# Altium schematic sheet Comm_SQUID.SchDoc: FPGA Motherboard for Digital Multiplexed Readout, McGill U.
size B; DocumentNumber: DfMUX19; Revision: Rev0, Prototype; SheetNumber: 19; SheetTotal: 27; PageSetup: Record=PageOptions|CenterHorizontal=True|CenterVertical=True|PrintScale=0.73|XCorrection=1.00|YCorrection=1.00|PrintKind=0|BorderSize=5000000|LeftOffset=0|BottomOffset=0|Orientation=2|PaperLength=1000|PaperWidth=1000|Scale=100|PaperSource=15|PrintQuality=600|MediaType=1|DitherType=10|PaperKind=Letter|PrintScaleMode=1
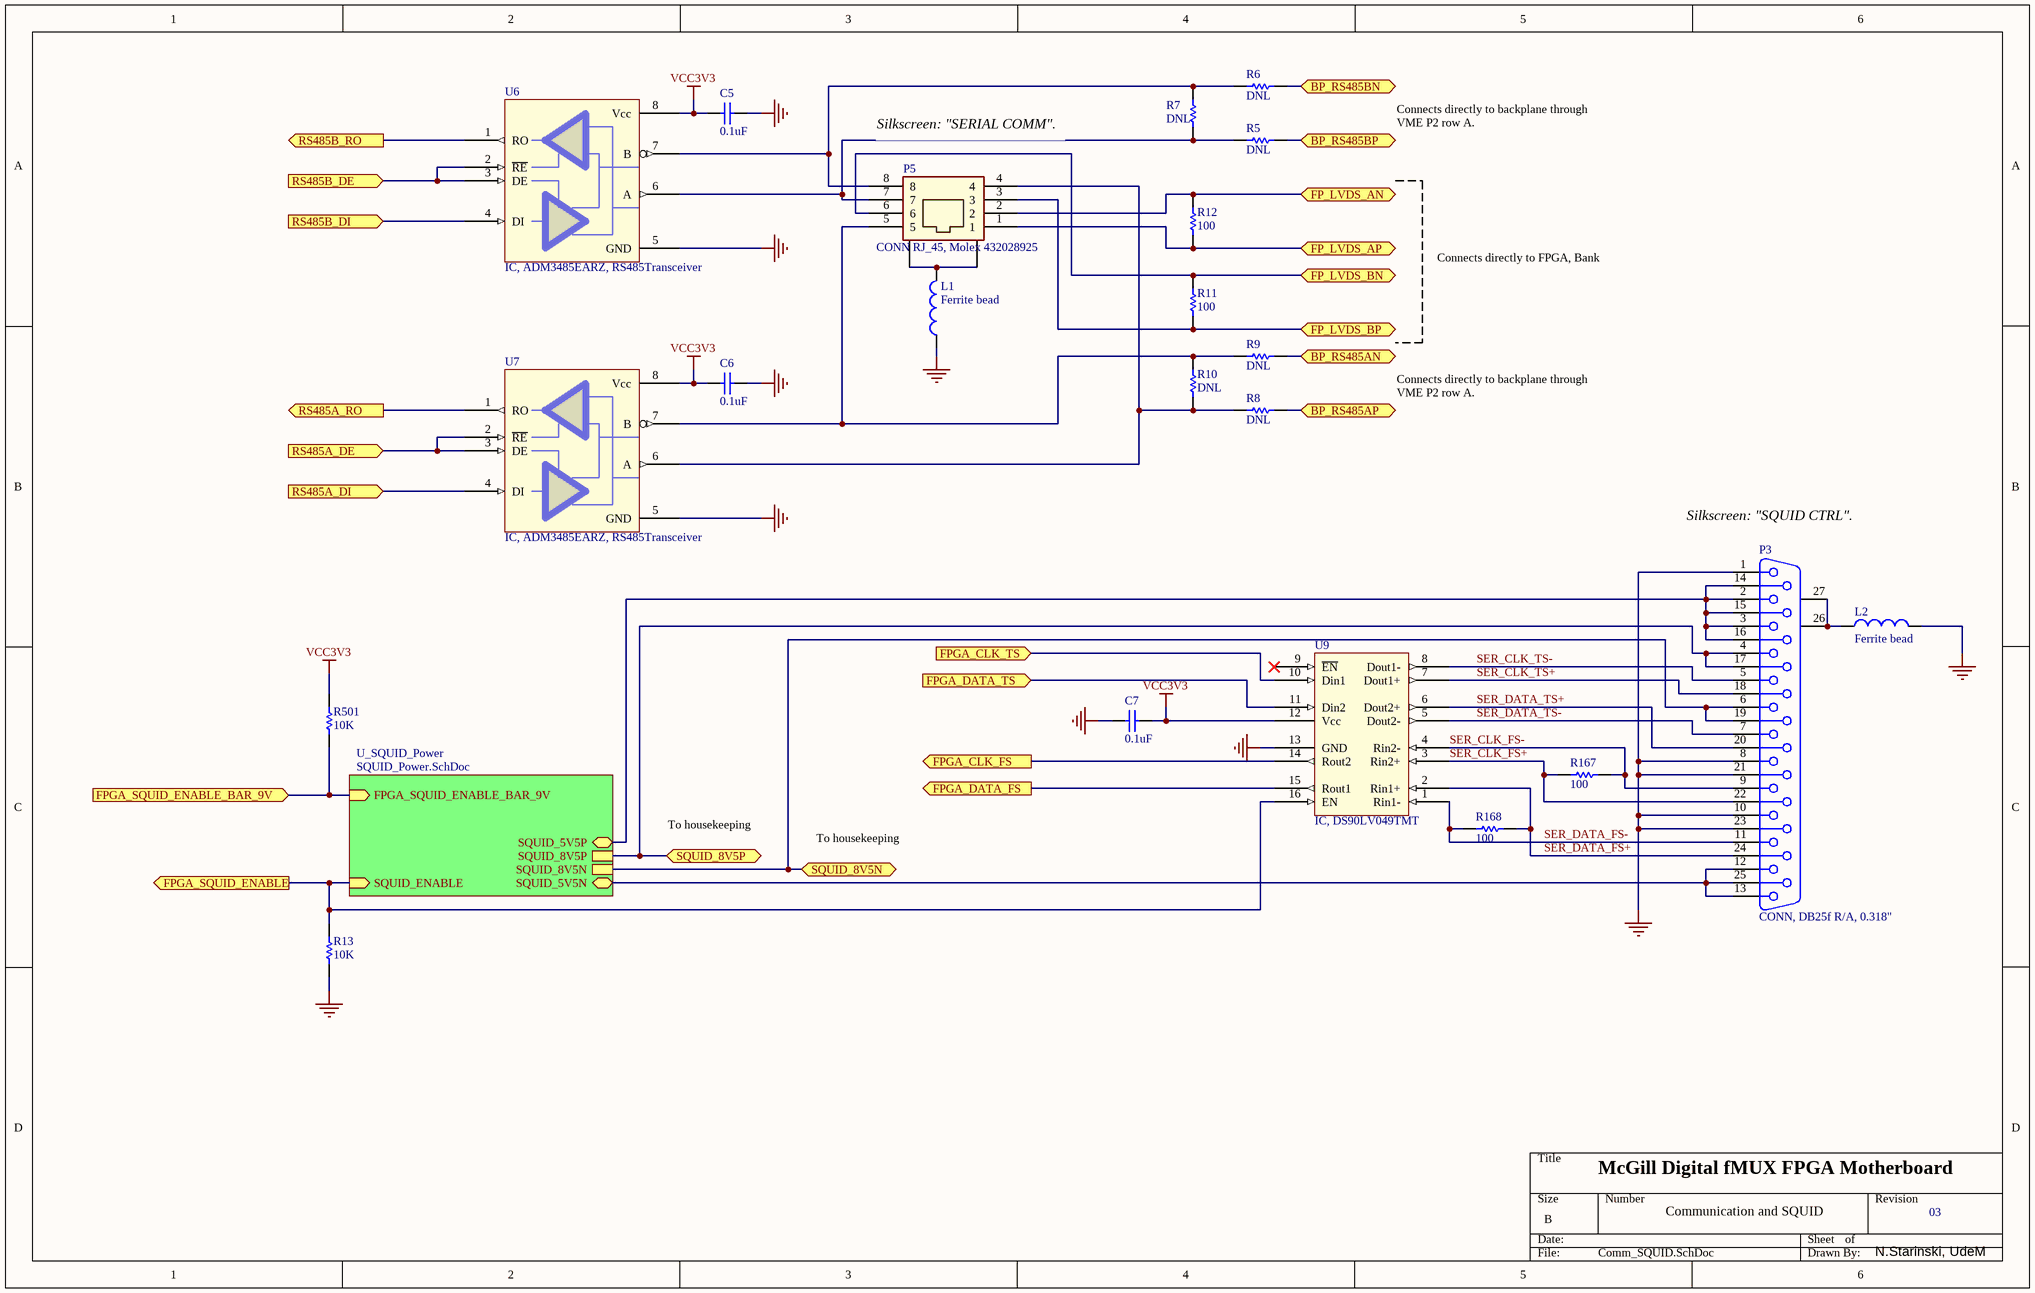
[diagram p0: Comm_SQUID.SchDoc]

## Parts
C5  0.1uF  [CC1608-0603]
C6  0.1uF  [CC1608-0603]
C7  0.1uF  [CC1608-0603]
L1  Ferrite bead  [INDC2012-0805]
L2  Ferrite bead  [INDC2012-0805]
P3  CONN, DB25f R/A, 0.318"  [DSUB1.385-2H25A]
P5  CONN RJ_45, Molex 432028925  [RJ45]
R5  DNL  [CR1608-0603]
R6  DNL  [CR1608-0603]
R7  DNL  [CR1608-0603]
R8  DNL  [CR1608-0603]
R9  DNL  [CR1608-0603]
R10  DNL  [CR1608-0603]
R11  100  [CR1608-0603]
R12  100  [CR1608-0603]
R13  10K  [CR1608-0603]
R167  100  [CR1608-0603]
R168  100  [CR1608-0603]
R501  10K  [1608[0603]]
U6  IC, ADM3485EARZ, RS485Transceiver  [SO-G8/Y1.9]
U7  IC, ADM3485EARZ, RS485Transceiver  [SO-G8/Y1.9]
U9  IC, DS90LV049TMT  [TSSO5x6-G16]

## Sub-sheets
U_SQUID_Power = SQUID_Power.SchDoc: SQUID_ENABLE (in), SQUID_5V5P (bidir), SQUID_5V5N (bidir), SQUID_8V5P, SQUID_8V5N, FPGA_SQUID_ENABLE_BAR_9V (in)

## Ports
BP_RS485AN (bidir), BP_RS485AP (bidir), BP_RS485BN (bidir), BP_RS485BP (bidir), FP_LVDS_AN (bidir), FP_LVDS_AP (bidir), FP_LVDS_BN (bidir), FP_LVDS_BP (bidir), FPGA_CLK_FS (out), FPGA_CLK_TS (in), FPGA_DATA_FS (out), FPGA_DATA_TS (in), FPGA_SQUID_ENABLE (out), FPGA_SQUID_ENABLE_BAR_9V (in), RS485A_DE (in), RS485A_DI (in), RS485A_RO (out), RS485B_DE (in), RS485B_DI (in), RS485B_RO (out), SQUID_8V5N, SQUID_8V5P

## Nets
GND: C5.2 C6.2 C7.1 L1.1 L2.2 P3.1 P3.8 P3.10 P3.21 P3.23 R13.1 U6.5(GND) U7.5(GND) U9.13(GND)
VCC3V3: C5.1 C6.1 C7.2 R501.2 U6.8(Vcc) U7.8(Vcc) U9.12(Vcc)
BP_RS485AN: R9.2 ; port BP_RS485AN
BP_RS485AP: R8.2 ; port BP_RS485AP
BP_RS485BN: R6.2 ; port BP_RS485BN
BP_RS485BP: R5.2 ; port BP_RS485BP
FP_LVDS_AN: P5.2 R12.2 ; port FP_LVDS_AN
FP_LVDS_AP: P5.1 R12.1 ; port FP_LVDS_AP
FP_LVDS_BN: P5.6 R11.2 ; port FP_LVDS_BN
FP_LVDS_BP: P5.3 R11.1 ; port FP_LVDS_BP
FPGA_CLK_FS: U9.14(Rout2) ; port FPGA_CLK_FS
FPGA_CLK_TS: U9.10(Din1) ; port FPGA_CLK_TS
FPGA_DATA_FS: U9.15(Rout1) ; port FPGA_DATA_FS
FPGA_DATA_TS: U9.11(Din2) ; port FPGA_DATA_TS
FPGA_SQUID_ENABLE: R13.2 U9.16(EN) ; port FPGA_SQUID_ENABLE, sheet U_SQUID_Power/SQUID_ENABLE
FPGA_SQUID_ENABLE_BAR_9V: R501.1 ; port FPGA_SQUID_ENABLE_BAR_9V, sheet U_SQUID_Power/FPGA_SQUID_ENABLE_BAR_9V
RS485A_DE: U7.2(~{RE}) U7.3(DE) ; port RS485A_DE
RS485A_DI: U7.4(DI) ; port RS485A_DI
RS485A_RO: U7.1(RO) ; port RS485A_RO
RS485B_DE: U6.2(~{RE}) U6.3(DE) ; port RS485B_DE
RS485B_DI: U6.4(DI) ; port RS485B_DI
RS485B_RO: U6.1(RO) ; port RS485B_RO
SER_CLK_FS+: P3.22 R167.1 U9.3(Rin2+)
SER_CLK_FS-: P3.9 R167.2 U9.4(Rin2-)
SER_CLK_TS+: P3.18 U9.7(Dout1+)
SER_CLK_TS-: P3.5 U9.8(Dout1-)
SER_DATA_FS+: P3.24 R168.2 U9.2(Rin1+)
SER_DATA_FS-: P3.11 R168.1 U9.1(Rin1-)
SER_DATA_TS+: P3.20 U9.6(Dout2+)
SER_DATA_TS-: P3.7 U9.5(Dout2-)
SQUID_8V5N: P3.6 P3.19 ; port SQUID_8V5N, sheet U_SQUID_Power/SQUID_8V5N
SQUID_8V5P: P3.4 P3.17 ; port SQUID_8V5P, sheet U_SQUID_Power/SQUID_8V5P
NetL1_2: L1.2 P5.9(GND) P5.10(GND)
NetL2_1: L2.1 P3.26(MH1) P3.27(MH2)
NetP3_2: P3.2 P3.3 P3.14 P3.15 P3.16 ; sheet U_SQUID_Power/SQUID_5V5P
NetP3_12: P3.12 P3.13 P3.25 ; sheet U_SQUID_Power/SQUID_5V5N
NetP5_4: P5.4 R8.1 R10.1 U7.6(A)
NetP5_5: P5.5 R9.1 R10.2 U7.7(B)
NetP5_7: P5.7 R5.1 R7.1 U6.6(A)
NetP5_8: P5.8 R6.1 R7.2 U6.7(B)

Not connected (* = marked no-connect by the designer): U9 9(~{EN})*

## Notes on the sheet
- (near P5) Silkscreen: "SERIAL COMM".
- Connects directly to backplane through VME P2 row A.
- Connects directly to FPGA, Bank 7.
- (near P3) Silkscreen: "SQUID CTRL".
- To housekeeping
- McGill Digital fMUX FPGA Motherboard
- Communication and SQUID
- 03
- N.Starinski, UdeM

## Library data of the parts
C5-C7 = Cap Semi: Capacitor (Semiconductor SIM Model); Published: 8-Jun-2000; LatestRevisionDate: 17-Jul-2002; LatestRevisionNote: Re-released for DXP Platform.; PackageReference: C1206; Publisher: Altium Limited
L1 L2 = Inductor: Inductor SM 0805; Code_IEC: 1005; Published: 8-Jun-2000; LatestRevisionDate: 17-Jul-2002; LatestRevisionNote: Re-released for DXP Platform.; PackageReference: 0402-A; Publisher: Altium Limited; Code_JEITA: 0402
P3 = D Connector 25: Amp 5747846-4 or ITT DBMG25SJA197; PackageDocument: U; Positions: 25; Gender: Receptacle; Published: 15-Jun-2001; LatestRevisionDate: 17-Jul-2002; LatestRevisionNote: Re-released for DXP Platform.; DatasheetDocument: 19-Mar-1999; PackageReference: 787202; Publisher: Altium Limited; Orientation: Right Angle
P5 = RJ_45: Molex 432028925
R5-R12 R167 R168 R501 = Res Semi: Semiconductor Resistor; Published: 8-Jun-2000; LatestRevisionDate: 17-Jul-2002; LatestRevisionNote: Re-released for DXP Platform.; Publisher: Altium Limited
  R501: PackageReference: AXIAL-0.5; Value: 10K
R13 = Res Semi: Resistor 0603; Published: 8-Jun-2000; LatestRevisionDate: 17-Jul-2002; LatestRevisionNote: Re-released for DXP Platform.; Publisher: Altium Limited
U6 U7 = ADM3485: 20 Mbps, EIA RS-485 Transceiver
U9 = DS90LV049: 3V LVDS Dual Line Transceiver